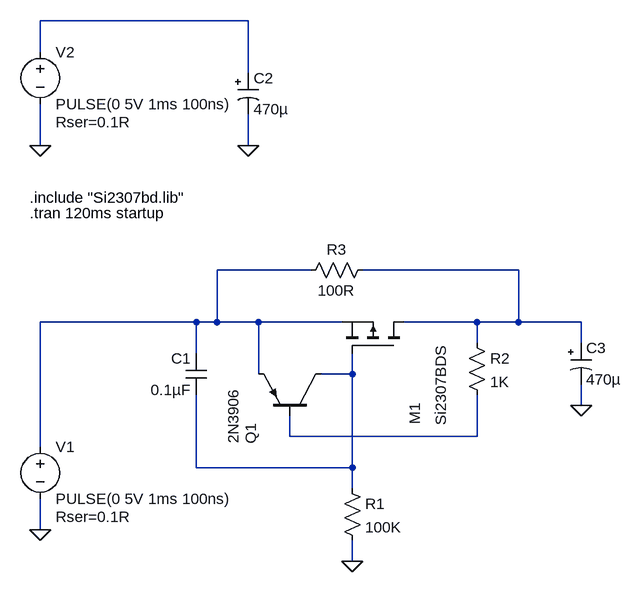
[diagram p0: schematic soft start.asc]
soft start.asc, the LTspice schematic file:
Version 4
SHEET 1 984 692
WIRE 272 -160 -48 -160
WIRE -48 -112 -48 -160
WIRE 272 -80 272 -160
WIRE -48 32 -48 -32
WIRE 272 32 272 -16
WIRE 368 224 224 224
WIRE 688 224 448 224
WIRE 192 304 -48 304
WIRE 224 304 224 224
WIRE 224 304 192 304
WIRE 288 304 224 304
WIRE 416 304 288 304
WIRE 624 304 512 304
WIRE 688 304 688 224
WIRE 688 304 624 304
WIRE 784 304 688 304
WIRE 624 336 624 304
WIRE 784 336 784 304
WIRE 192 352 192 304
WIRE 288 384 288 304
WIRE 432 384 432 352
WIRE 432 384 384 384
WIRE 784 432 784 400
WIRE 336 480 336 448
WIRE 624 480 624 416
WIRE 624 480 336 480
WIRE -48 496 -48 304
WIRE 192 528 192 416
WIRE 432 528 432 384
WIRE 432 528 192 528
WIRE 432 560 432 528
WIRE -48 624 -48 576
WIRE 432 672 432 640
FLAG -48 624 0
FLAG 784 432 0
FLAG 432 672 0
FLAG -48 32 0
FLAG 272 32 0
SYMBOL voltage -48 480 R0
WINDOW 123 0 0 Left 2
WINDOW 39 24 124 Left 2
SYMATTR SpiceLine Rser=0.1R
SYMATTR InstName V1
SYMATTR Value PULSE(0 5V 1ms 100ns)
SYMBOL polcap 768 336 R0
WINDOW 3 24 56 Left 2
SYMATTR Value 470µ
SYMATTR InstName C3
SYMATTR Description Capacitor
SYMATTR Type cap
SYMATTR SpiceLine V=25 Irms=1.01 Rser=0.065 Lser=0 mfg="Panasonic" pn="ECA1EFQ471" type="Al electrolytic"
SYMBOL pmos 512 352 M270
WINDOW 3 56 72 Invisible 2
WINDOW 38 -112 -56 Left 2
WINDOW 0 -110 -16 Left 2
SYMATTR Value ""
SYMATTR SpiceModel Si2307BDS
SYMATTR InstName M1
SYMATTR Prefix X
SYMBOL res 416 544 R0
SYMATTR InstName R1
SYMATTR Value 100K
SYMBOL pnp 384 448 M270
WINDOW 0 -44 108 Left 2
WINDOW 3 -43 135 Left 2
SYMATTR InstName Q1
SYMATTR Value 2N3906
SYMBOL res 608 320 R0
SYMATTR InstName R2
SYMATTR Value 1K
SYMBOL res 464 208 R90
WINDOW 0 0 56 VBottom 2
WINDOW 3 32 56 VTop 2
SYMATTR InstName R3
SYMATTR Value 100R
SYMBOL cap 208 416 R180
WINDOW 0 24 56 Left 2
WINDOW 3 24 8 Left 2
SYMATTR InstName C1
SYMATTR Value 0.1µF
SYMBOL polcap 256 -80 R0
WINDOW 3 24 56 Left 2
SYMATTR Value 470µ
SYMATTR InstName C2
SYMATTR Description Capacitor
SYMATTR Type cap
SYMATTR SpiceLine V=25 Irms=1.01 Rser=0.065 Lser=0 mfg="Panasonic" pn="ECA1EFQ471" type="Al electrolytic"
SYMBOL voltage -48 -128 R0
WINDOW 123 0 0 Left 2
WINDOW 39 24 124 Left 2
SYMATTR SpiceLine Rser=0.1R
SYMATTR InstName V2
SYMATTR Value PULSE(0 5V 1ms 100ns)
TEXT -64 112 Left 2 !.include "Si2307bd.lib"
TEXT -64 136 Left 2 !.tran 120ms startup

The netlist it stands for:
* soft start.asc
V1 N002 0 PULSE(0 5V 1ms 100ns) Rser=0.1R
C3 N003 0 470µ V=25 Irms=1.01 Rser=0.065 Lser=0 mfg="Panasonic" pn="ECA1EFQ471" type="Al electrolytic"
XM1 N003 N004 N002 Si2307BDS  ; pins D G S
R1 N004 0 100K
Q1 N004 N005 N002 0 2N3906
R2 N003 N005 1K
R3 N003 N002 100R
C1 N004 N002 0.1µF
C2 N001 0 470µ V=25 Irms=1.01 Rser=0.065 Lser=0 mfg="Panasonic" pn="ECA1EFQ471" type="Al electrolytic"
V2 N001 0 PULSE(0 5V 1ms 100ns) Rser=0.1R
.model NPN NPN
.model PNP PNP
.lib standard.bjt
.include "Si2307bd.lib"
.tran 120ms startup
.backanno
.end